# Altium schematic sheet ESP32.SchDoc: ESP32
size 342 x 241 mm; DrawnBy: Kace Chandler; DocumentNumber: 14; SheetNumber: 14; SheetTotal: 23
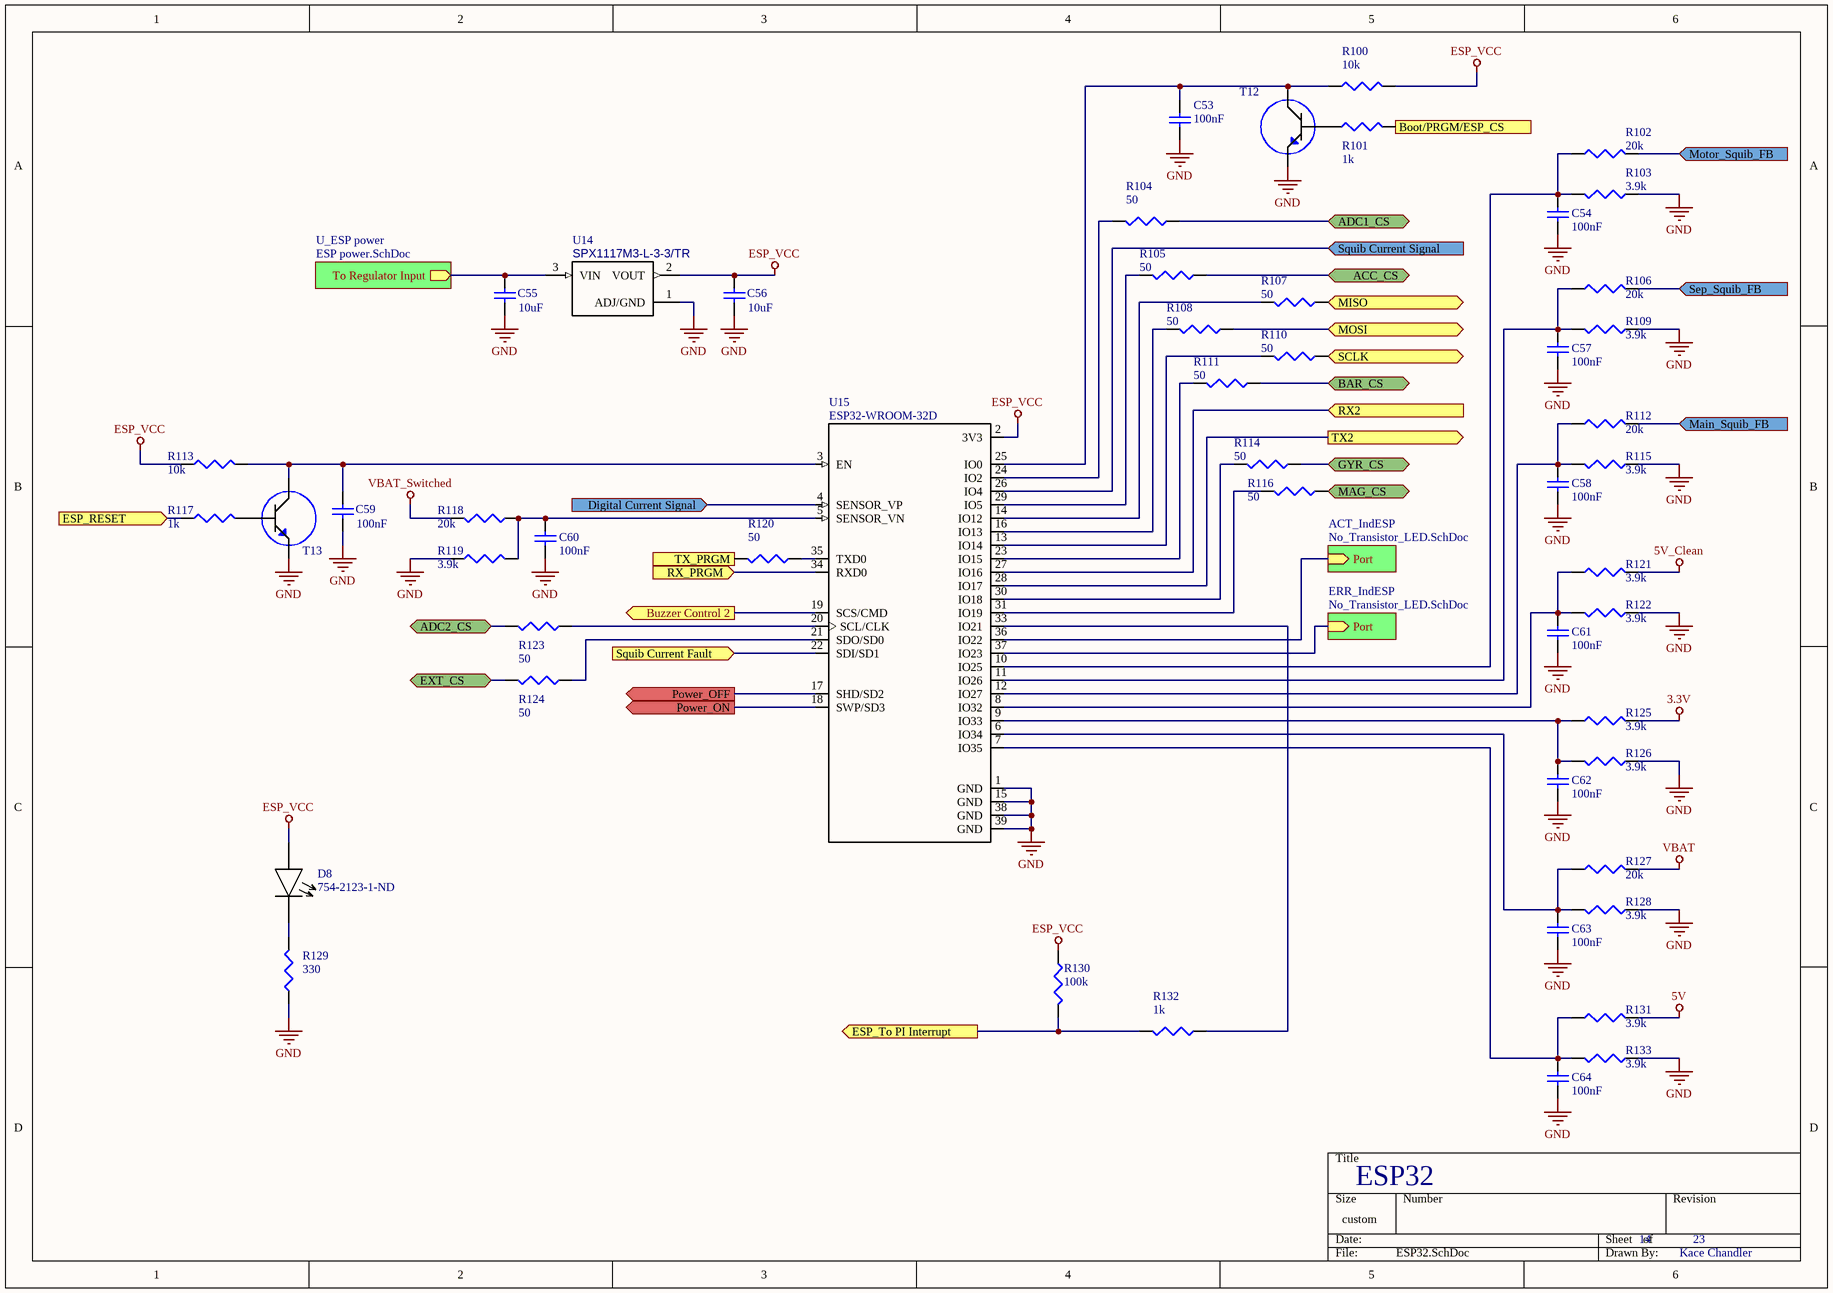
[diagram p0: ESP32.SchDoc]

## Parts
C53  value 100nF  [0805 Footprint]  (hidden comment: Cap)
C54  value 100nF  [0603 Footprint]  (hidden comment: Cap)
C55  value 10uF  [0805 Footprint]  (hidden comment: Cap)
C56  value 10uF  [0805 Footprint]  (hidden comment: Cap)
C57  value 100nF  [0603 Footprint]  (hidden comment: Cap)
C58  value 100nF  [0603 Footprint]  (hidden comment: Cap)
C59  value 100nF  [0805 Footprint]  (hidden comment: Cap)
C60  value 100nF  [0603 Footprint]  (hidden comment: Cap)
C61  value 100nF  [0603 Footprint]  (hidden comment: Cap)
C62  value 100nF  [0603 Footprint]  (hidden comment: Cap)
C63  value 100nF  [0603 Footprint]  (hidden comment: Cap)
C64  value 100nF  [0603 Footprint]  (hidden comment: Cap)
D8  Supplier Part Number 1: 754-2123-1-ND  [0402 footprint]  (hidden comment: LED_R)
R100  value 10k  (hidden comment: Res3)
R101  value 1k  (hidden comment: Res3)
R102  value 20k  (hidden comment: Res3)
R103  value 3.9k  (hidden comment: Res3)
R104  value 50  (hidden comment: Res3)
R105  value 50  (hidden comment: Res3)
R106  value 20k  (hidden comment: Res3)
R107  value 50  (hidden comment: Res3)
R108  value 50  (hidden comment: Res3)
R109  value 3.9k  (hidden comment: Res3)
R110  value 50  (hidden comment: Res3)
R111  value 50  (hidden comment: Res3)
R112  value 20k  (hidden comment: Res3)
R113  value 10k  (hidden comment: Res3)
R114  value 50  (hidden comment: Res3)
R115  value 3.9k  (hidden comment: Res3)
R116  value 50  (hidden comment: Res3)
R117  value 1k  (hidden comment: Res3)
R118  value 20k  (hidden comment: Res3)
R119  value 3.9k  (hidden comment: Res3)
R120  value 50  (hidden comment: Res3)
R121  value 3.9k  (hidden comment: Res3)
R122  value 3.9k  (hidden comment: Res3)
R123  value 50  (hidden comment: Res3)
R124  value 50  (hidden comment: Res3)
R125  value 3.9k  (hidden comment: Res3)
R126  value 3.9k  (hidden comment: Res3)
R127  value 20k  (hidden comment: Res3)
R128  value 3.9k  (hidden comment: Res3)
R129  value 330  (hidden comment: Res3)
R130  value 100k  [J1-0603]  (hidden comment: Res3)
R131  value 3.9k  (hidden comment: Res3)
R132  value 1k  (hidden comment: Res3)
R133  value 3.9k  (hidden comment: Res3)
T12  MMBT2222ALT1  [BJT]  (value not drawn)
T13  MMBT2222ALT1  [BJT]  (value not drawn)
U14  MP: SPX1117M3-L-3-3/TR  [*DPAK229P990X238-4N]  (hidden comment: 3.3V Regulator)
U15  ESP32-WROOM-32D  [*MODULE_ESP32-WROOM-32D]

## Sub-sheets
ACT_IndESP = No_Transistor_LED.SchDoc: Port (in)
ERR_IndESP = No_Transistor_LED.SchDoc: Port (in)
U_ESP power = ESP power.SchDoc: To Regulator Input (out)

## Ports
ACC_CS (bidir), ADC1_CS (bidir), ADC2_CS (bidir), BAR_CS (bidir), Boot/PRGM/ESP_CS (in), Buzzer Control 2 (out), Digital Current Signal (in), ESP_RESET (in), ESP_To PI Interrupt (out), EXT_CS (bidir), GYR_CS (bidir), MAG_CS (bidir), Main_Squib_FB (in), MISO (bidir), MOSI (bidir), Motor_Squib_FB (in), Power_OFF (out), Power_ON (out), RX2 (in), RX_PRGM (in), SCLK (bidir), Sep_Squib_FB (in), Squib Current Fault (in), Squib Current Signal (in), TX2 (out), TX_PRGM (out)

## Nets
3.3V: R125.2
5V: R131.2
5V_Clean: R121.2
ESP_VCC: C56.2 D8.1 R100.1 R113.1 R130.1 U14.2(VOUT) U15.2(3V3)
GND: C53.1 C54.1 C55.1 C56.1 C57.1 C58.1 C59.1 C60.1 C61.1 C62.1 C63.1 C64.1 R103.1 R109.1 R115.1 R119.1 R122.1 R126.1 R128.1 R129.1 R133.1 T12.2(E) T13.2(E) U14.1(ADJ/GND) U15.1(GND) U15.15(GND) U15.38(GND) U15.39(GND)
VBAT: R127.2
VBAT_Switched: R118.2
ACC_CS: R105.1 ; port ACC_CS
ADC1_CS: R104.1 ; port ADC1_CS
ADC2_CS: R123.2 ; port ADC2_CS
BAR_CS: R111.1 ; port BAR_CS
Boot/PRGM/ESP_CS: R101.2 ; port Boot/PRGM/ESP_CS
Buzzer Control 2: U15.19(SCS/CMD) ; port Buzzer Control 2
Digital Current Signal: U15.4(SENSOR_VP) ; port Digital Current Signal
ESP_RESET: R117.1 ; port ESP_RESET
ESP_To PI Interrupt: R130.2 R132.2 ; port ESP_To PI Interrupt
EXT_CS: R124.2 ; port EXT_CS
GYR_CS: R114.1 ; port GYR_CS
MAG_CS: R116.1 ; port MAG_CS
Main_Squib_FB: R112.2 ; port Main_Squib_FB
MISO: R107.1 ; port MISO
MOSI: R108.1 ; port MOSI
Motor_Squib_FB: R102.2 ; port Motor_Squib_FB
Power_OFF: U15.17(SHD/SD2) ; port Power_OFF
Power_ON: U15.18(SWP/SD3) ; port Power_ON
RX2: U15.27(IO16) ; port RX2
RX_PRGM: U15.34(RXD0) ; port RX_PRGM
SCLK: R110.1 ; port SCLK
Sep_Squib_FB: R106.2 ; port Sep_Squib_FB
Squib Current Fault: U15.22(SDI/SD1) ; port Squib Current Fault
Squib Current Signal: U15.26(IO4) ; port Squib Current Signal
TX2: U15.28(IO17) ; port TX2
TX_PRGM: R120.2 ; port TX_PRGM
NetC53_2: C53.2 R100.2 T12.3(C) U15.25(IO0)
NetC54_2: C54.2 R102.1 R103.2 U15.10(IO25)
NetC55_2: C55.2 U14.3(VIN) ; sheet U_ESP power/To Regulator Input
NetC57_2: C57.2 R106.1 R109.2 U15.11(IO26)
NetC58_2: C58.2 R112.1 R115.2 U15.12(IO27)
NetC59_2: C59.2 R113.2 T13.3(C) U15.3(EN)
NetC60_2: C60.2 R118.1 R119.2 U15.5(SENSOR_VN)
NetC61_2: C61.2 R121.1 R122.2 U15.8(IO32)
NetC62_2: C62.2 R125.1 R126.2 U15.9(IO33)
NetC63_2: C63.2 R127.1 R128.2 U15.6(IO34)
NetC64_2: C64.2 R131.1 R133.2 U15.7(IO35)
NetD8_2: D8.2 R129.2
NetR101_1: R101.1 T12.1(B)
NetR104_2: R104.2 U15.24(IO2)
NetR105_2: R105.2 U15.29(IO5)
NetR107_2: R107.2 U15.14(IO12)
NetR108_2: R108.2 U15.16(IO13)
NetR110_2: R110.2 U15.13(IO14)
NetR111_2: R111.2 U15.23(IO15)
NetR114_2: R114.2 U15.30(IO18)
NetR116_2: R116.2 U15.31(IO19)
NetR117_2: R117.2 T13.1(B)
NetR120_1: R120.1 U15.35(TXD0)
NetR123_1: R123.1 U15.20(SCL/CLK)
NetR124_1: R124.1 U15.21(SDO/SD0)
NetR132_1: R132.1 U15.33(IO21)
NetU15_36: U15.36(IO22) ; sheet ACT_IndESP/Port
NetU15_37: U15.37(IO23) ; sheet ERR_IndESP/Port

## Library data of the parts
C54-C58 C60-C64 = Cap: Capacitor; Published: 8-Jun-2000; LatestRevisionDate: 17-Jul-2002; LatestRevisionNote: Re-released for DXP Platform.; PackageReference: RAD-0.3; Publisher: Altium Limited; PackageDescription: Radial Cap, Thru-Hole; 2 Leads; 0.3 in Pin Spacing
R100-R133 = Res3: Resistor; Published: 8-Jun-2000; LatestRevisionDate: 29-May-2009; LatestRevisionNote: IPC-7351 Footprint Added.; PackageReference: J1-0603; Publisher: Altium Limited; PackageDescription: Chip Resistor
T12 T13 = BJT NPN: Trans NPN 40V 0.6A SOT23; MF: ON Semiconductor; SnapEDA_Link: https://www.snapeda.com/parts/MMBT2222ALT1/ON%20Semiconductor/view-part/?ref=snap; Price: None; Availability: Unavailable; MP: MMBT2222ALT1; Package: SOT-23 Motorola; Value: *; Supplier 1: Digi-Key; Supplier Part Number 1: MMBT2222ATPMSCT-ND
U14 = 3-3VReg: NCP1117DT33T5GOSCT-ND 3.3V linear regulator; MF: MaxLinear, Inc.; Availability: Unavailable; Price: None; Package: SOT-223 Exar; SnapEDA_Link: https://www.snapeda.com/parts/SPX1117M3-L-3-3/TR/MaxLinear%2C%20Inc./view-part/?ref=snap; Value: *; Supplier 1: Digi-Key; Supplier Part Number 1: NCP1117DT33T5GOSCT-ND
U15 = ESP32-WROOM-32D: IC: SoC; GPIO, I2C, I2S, IR, SD, SDIO, SPI, UART; 2.7Ã·3.6VDC; 20dBm; MF: Espressif Systems; SnapEDA_Link: https://www.snapeda.com/parts/ESP32-WROOM-32D/Espressif%20Systems/view-part/?ref=snap; Availability: Unavailable; Package: Module Espressif Systems; Price: None; MP: ESP32-WROOM-32D; Value: *; Supplier 1: Digi-Key; Supplier Part Number 1: 1904-1023-1-ND
D8 = LED_R: Supplier 1: Digi-Key